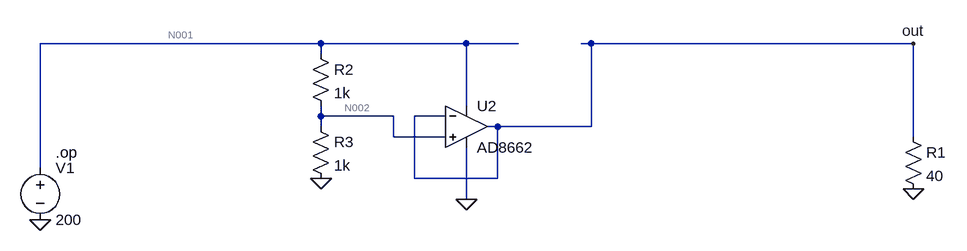
[diagram p0: schematic VoltageRegulator.asc]
VoltageRegulator.asc, the LTspice schematic file:
Version 4
SHEET 1 1016 856
WIRE -144 176 -576 176
WIRE 80 176 -144 176
WIRE 160 176 80 176
WIRE 272 176 256 176
WIRE 768 176 272 176
WIRE -144 192 -144 176
WIRE 80 272 80 176
WIRE -144 288 -144 272
WIRE -32 288 -144 288
WIRE 48 288 0 288
WIRE -144 304 -144 288
WIRE 128 304 112 304
WIRE 272 304 272 176
WIRE 272 304 128 304
WIRE -32 320 -32 288
WIRE 48 320 -32 320
WIRE 768 320 768 176
WIRE -576 368 -576 176
WIRE 0 384 0 288
WIRE 128 384 128 304
WIRE 128 384 0 384
WIRE 80 416 80 336
FLAG 768 400 0
FLAG -576 448 0
FLAG 768 176 out
FLAG 80 416 0
FLAG -144 384 0
SYMBOL voltage -576 352 R0
WINDOW 123 0 0 Left 0
WINDOW 39 0 0 Left 0
SYMATTR InstName V1
SYMATTR Value 200
SYMBOL res 752 304 R0
SYMATTR InstName R1
SYMATTR Value 40
SYMBOL res -160 176 R0
SYMATTR InstName R2
SYMATTR Value 1k
SYMBOL res -160 288 R0
SYMATTR InstName R3
SYMATTR Value 1k
SYMBOL OpAmps\\AD8662 80 240 R0
SYMATTR InstName U2
TEXT -552 344 Left 2 !.op

The netlist it stands for:
* VoltageRegulator.asc
V1 N001 0 200
R1 out 0 40
R2 N001 N002 1k
R3 N002 0 1k
XU2 N002 out N001 0 out AD8662  ; pins In+ In- V+ V- OUT
.op
.backanno
.end

* Results of the author's LTspice run, read from the files saved beside the schematic
* Operating Point:
*   V(n001) = 200 V
*   V(out) = 95.82 nV
*   V(n002) = 100 V
*   I(R3) = 100 mA
*   I(R2) = 100 mA
*   I(R1) = 2.396 nA
*   I(V1) = -593.1 mA
*   Ix(u2:1) = 99.97 fA
*   Ix(u2:2) = -100 fA
*   Ix(u2:99) = 493.1 mA
*   Ix(u2:50) = -493.1 mA
*   Ix(u2:45) = 69.09 nA